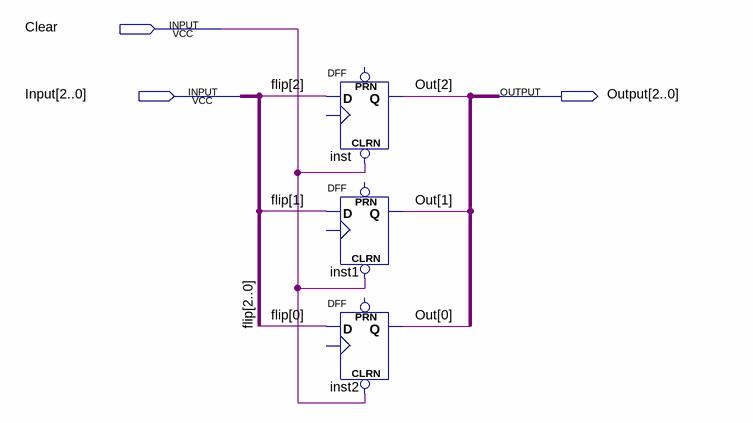
[diagram p0: schematic sheet]
// Quartus schematic FlipFlop3.bdf as structural Verilog: 3 symbols, 3 pins
module FlipFlop3 (
  input  Clear,
  input  [2:0] Input,
  output [2:0] Output
);

  wire [2:0] Out;

  DFF inst (.CLRN(Clear), .D(Input[2]), .Q(Out[2]));  // open: CLK, PRN
  DFF inst1 (.CLRN(Clear), .D(Input[1]), .Q(Out[1]));  // open: CLK, PRN
  DFF inst2 (.CLRN(Clear), .D(Input[0]), .Q(Out[0]));  // open: CLK, PRN

  // Other names for the same wires on the sheet: flip[2:0] = Input
endmodule
